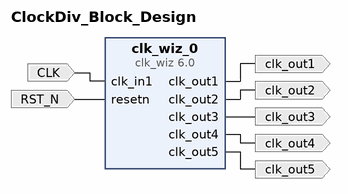
[diagram p0: block diagram of the top level]
# Vivado block design ClockDiv_Block_Design, xcvu9p-flga2104-2L-e, Vivado 2019.1
create_bd_design ClockDiv_Block_Design

create_bd_port -dir I -type clk CLK
set_property -dict {CONFIG.FREQ_HZ 250000000} [get_bd_ports CLK]
create_bd_port -dir I -type rst RST_N
set_property -dict {CONFIG.POLARITY ACTIVE_LOW} [get_bd_ports RST_N]
create_bd_port -dir O -type clk clk_out1
create_bd_port -dir O -type clk clk_out2
set_property -dict {CONFIG.FREQ_HZ 100000000} [get_bd_ports clk_out2]
create_bd_port -dir O -type clk clk_out3
set_property -dict {CONFIG.FREQ_HZ 50000000} [get_bd_ports clk_out3]
create_bd_port -dir O -type clk clk_out5
set_property -dict {CONFIG.FREQ_HZ 10000000} [get_bd_ports clk_out5]
create_bd_port -dir O -type clk clk_out4
set_property -dict {CONFIG.FREQ_HZ 25000000} [get_bd_ports clk_out4]

create_bd_cell -type ip -vlnv xilinx.com:ip:clk_wiz:6.0 clk_wiz_0
set_property -dict [list \
  CONFIG.CLKIN1_JITTER_PS 40.0 \
  CONFIG.CLKOUT1_JITTER 102.531 \
  CONFIG.CLKOUT1_PHASE_ERROR 85.928 \
  CONFIG.CLKOUT1_REQUESTED_OUT_FREQ 125.000 \
  CONFIG.CLKOUT2_JITTER 107.111 \
  CONFIG.CLKOUT2_PHASE_ERROR 85.928 \
  CONFIG.CLKOUT2_REQUESTED_OUT_FREQ 100.000 \
  CONFIG.CLKOUT2_USED true \
  CONFIG.CLKOUT3_JITTER 123.073 \
  CONFIG.CLKOUT3_PHASE_ERROR 85.928 \
  CONFIG.CLKOUT3_REQUESTED_OUT_FREQ 50.000 \
  CONFIG.CLKOUT3_USED true \
  CONFIG.CLKOUT4_JITTER 141.604 \
  CONFIG.CLKOUT4_PHASE_ERROR 85.928 \
  CONFIG.CLKOUT4_REQUESTED_OUT_FREQ 25.000 \
  CONFIG.CLKOUT4_USED true \
  CONFIG.CLKOUT5_JITTER 169.738 \
  CONFIG.CLKOUT5_PHASE_ERROR 85.928 \
  CONFIG.CLKOUT5_REQUESTED_OUT_FREQ 10.000 \
  CONFIG.CLKOUT5_USED true \
  CONFIG.MMCM_CLKFBOUT_MULT_F 4.000 \
  CONFIG.MMCM_CLKIN1_PERIOD 4.000 \
  CONFIG.MMCM_CLKIN2_PERIOD 10.0 \
  CONFIG.MMCM_CLKOUT0_DIVIDE_F 8.000 \
  CONFIG.MMCM_CLKOUT1_DIVIDE 10 \
  CONFIG.MMCM_CLKOUT2_DIVIDE 20 \
  CONFIG.MMCM_CLKOUT3_DIVIDE 40 \
  CONFIG.MMCM_CLKOUT4_DIVIDE 100 \
  CONFIG.MMCM_DIVCLK_DIVIDE 1 \
  CONFIG.NUM_OUT_CLKS 5 \
  CONFIG.PRIM_IN_FREQ 250.000 \
  CONFIG.RESET_PORT resetn \
  CONFIG.RESET_TYPE ACTIVE_LOW \
  CONFIG.USE_LOCKED false \
] [get_bd_cells clk_wiz_0]

# ---- connections ----

connect_bd_net -net clk_in1_0_1 [get_bd_ports CLK] [get_bd_pins clk_wiz_0/clk_in1]
connect_bd_net [get_bd_pins clk_wiz_0/clk_out1] [get_bd_ports clk_out1]
connect_bd_net [get_bd_pins clk_wiz_0/clk_out2] [get_bd_ports clk_out2]
connect_bd_net [get_bd_pins clk_wiz_0/clk_out3] [get_bd_ports clk_out3]
connect_bd_net -net reset_in_250_1 [get_bd_ports RST_N] [get_bd_pins clk_wiz_0/resetn]
connect_bd_net [get_bd_pins clk_wiz_0/clk_out5] [get_bd_ports clk_out5]
connect_bd_net [get_bd_pins clk_wiz_0/clk_out4] [get_bd_ports clk_out4]

validate_bd_design
save_bd_design
